# EAGLE design Backplane (EAGLE 6.4)
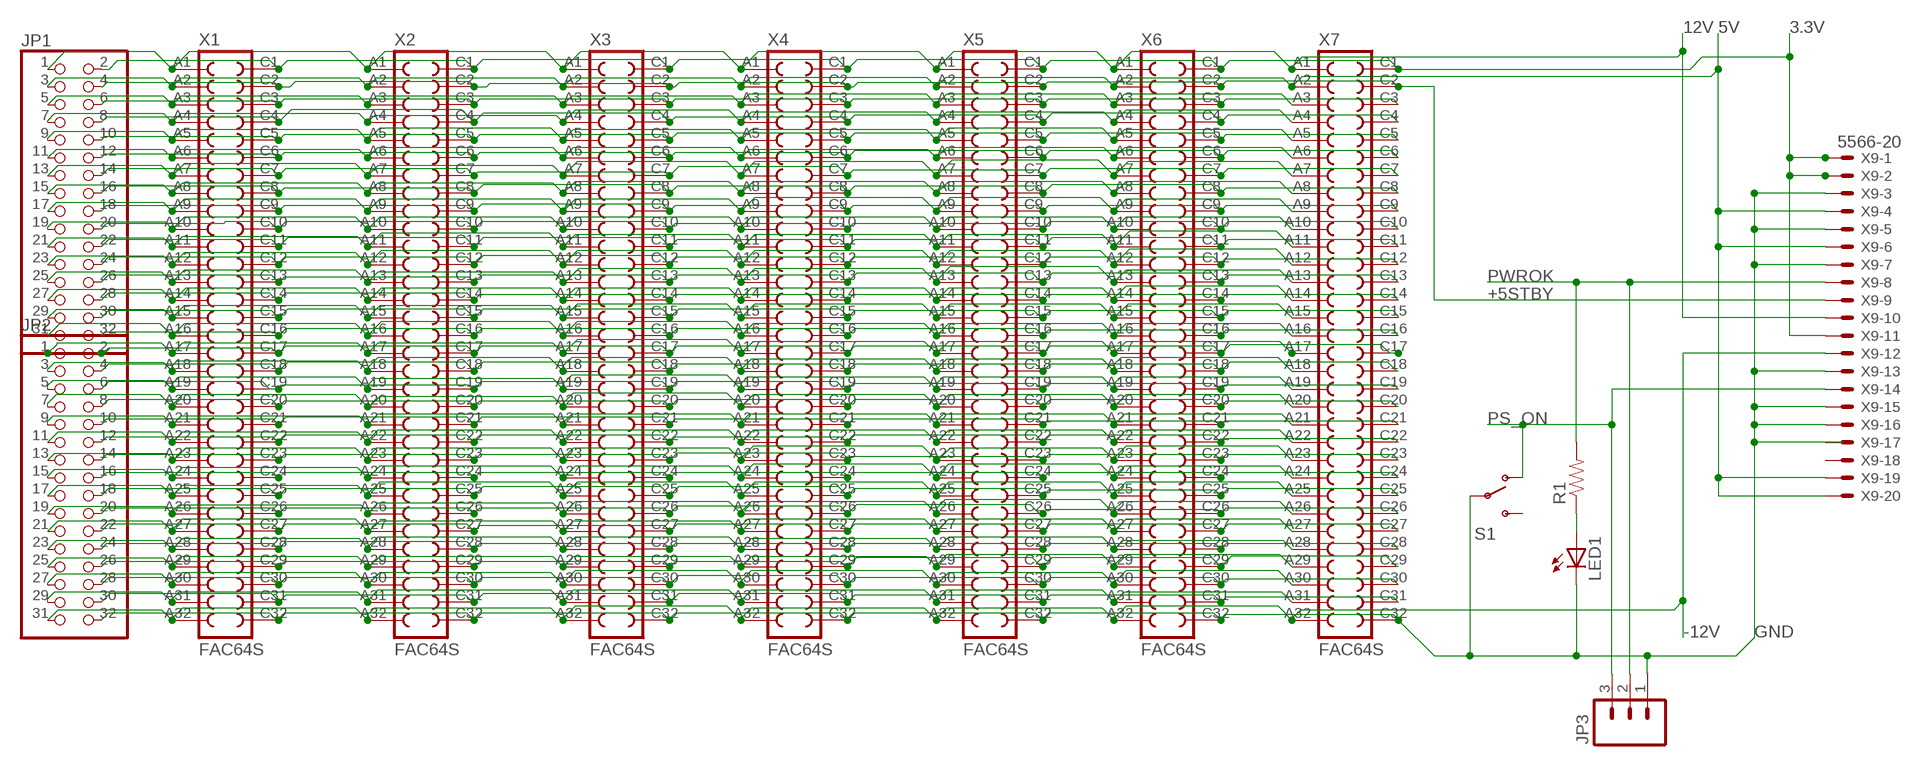
[diagram p0: schematic, sheet 1]

## Parts
JP1  PINHD-2X16  [2X16]
JP2  PINHD-2X16  [2X16]
JP3  M03LONGPADS  [1X03_LONGPADS]
LED1  LED3MM  [LED3MM]
R1  RESISTORKIT  [AXIAL-0.3-KIT]
S1  SWITCH-SPDTPTH  [SWITCH-SPDT]
X1  FAC64S  [FAC64S]
X2  FAC64S  [FAC64S]
X3  FAC64S  [FAC64S]
X4  FAC64S  [FAC64S]
X5  FAC64S  [FAC64S]
X6  FAC64S  [FAC64S]
X7  FAC64S  [FAC64S]
X9  5566-20  [5566-20]

## Nets
3.3V: JP1.2 X1.C1 X2.C1 X3.C1 X4.C1 X5.C1 X6.C1 X7.C1 X9.1 X9.2 X9.11
5V: JP1.3 X1.A2 X2.A2 X3.A2 X4.A2 X5.A2 X6.A2 X7.A2 X9.4 X9.6 X9.19 X9.20
12V: JP1.1 X1.A1 X2.A1 X3.A1 X4.A1 X5.A1 X6.A1 X7.A1 X9.10
+5STBY: JP1.4 X1.C2 X2.C2 X3.C2 X4.C2 X5.C2 X6.C2 X7.C2 X9.9
-12V: JP2.31 X1.A32 X2.A32 X3.A32 X4.A32 X5.A32 X6.A32 X7.A32 X9.12
GND: JP2.32 JP3.1 LED1.K(C) S1.2(P) X1.C32 X2.C32 X3.C32 X4.C32 X5.C32 X6.C32 X7.C32 X9.3 X9.5 X9.7 X9.13 X9.15 X9.16
N$1: LED1.A R1.P$1
N$5: JP1.5 X1.A3 X2.A3 X3.A3 X4.A3 X5.A3 X6.A3 X7.A3
N$6: JP1.6 X1.C3 X2.C3 X3.C3 X4.C3 X5.C3 X6.C3 X7.C3
N$7: JP1.7 X1.A4 X2.A4 X3.A4 X4.A4 X5.A4 X6.A4 X7.A4
N$8: JP1.8 X1.C4 X2.C4 X3.C4 X4.C4 X5.C4 X6.C4 X7.C4
N$9: JP1.9 X1.A5 X2.A5 X3.A5 X4.A5 X5.A5 X6.A5 X7.A5
N$10: JP1.10 X1.C5 X2.C5 X3.C5 X4.C5 X5.C5 X6.C5 X7.C5
N$11: JP1.11 X1.A6 X2.A6 X3.A6 X4.A6 X5.A6 X6.A6 X7.A6
N$12: JP1.12 X1.C6 X2.C6 X3.C6 X4.C6 X5.C6 X6.C6 X7.C6
N$13: JP1.13 X1.A7 X2.A7 X3.A7 X4.A7 X5.A7 X6.A7 X7.A7
N$14: JP1.14 X1.C7 X2.C7 X3.C7 X4.C7 X5.C7 X6.C7 X7.C7
N$15: JP1.15 X1.A8 X2.A8 X3.A8 X4.A8 X5.A8 X6.A8 X7.A8
N$16: JP1.16 X1.C8 X2.C8 X3.C8 X4.C8 X5.C8 X6.C8 X7.C8
N$17: JP1.17 X1.A9 X2.A9 X3.A9 X4.A9 X5.A9 X6.A9 X7.A9
N$80: JP1.18 X1.C9 X2.C9 X3.C9 X4.C9 X5.C9 X6.C9 X7.C9
N$81: JP1.19 X1.A10 X2.A10 X3.A10 X4.A10 X5.A10 X6.A10 X7.A10
N$82: JP1.20 X1.C10 X2.C10 X3.C10 X4.C10 X5.C10 X6.C10 X7.C10
N$83: JP1.21 X1.A11 X2.A11 X3.A11 X4.A11 X5.A11 X6.A11 X7.A11
N$84: JP1.22 X1.C11 X2.C11 X3.C11 X4.C11 X5.C11 X6.C11 X7.C11
N$85: JP1.23 X1.A12 X2.A12 X3.A12 X4.A12 X5.A12 X6.A12 X7.A12
N$86: JP1.24 X1.C12 X2.C12 X3.C12 X4.C12 X5.C12 X6.C12 X7.C12
N$87: JP1.25 X1.A13 X2.A13 X3.A13 X4.A13 X5.A13 X6.A13 X7.A13
N$88: JP1.26 X1.C13 X2.C13 X3.C13 X4.C13 X5.C13 X6.C13 X7.C13
N$89: JP1.27 X1.A14 X2.A14 X3.A14 X4.A14 X5.A14 X6.A14 X7.A14
N$90: JP1.28 X1.C14 X2.C14 X3.C14 X4.C14 X5.C14 X6.C14 X7.C14
N$91: JP1.29 X1.A15 X2.A15 X3.A15 X4.A15 X5.A15 X6.A15 X7.A15
N$92: JP1.30 X1.C15 X2.C15 X3.C15 X4.C15 X5.C15 X6.C15 X7.C15
N$93: JP1.31 X1.A16 X2.A16 X3.A16 X4.A16 X5.A16 X6.A16 X7.A16
N$94: JP1.32 X1.C16 X2.C16 X3.C16 X4.C16 X5.C16 X6.C16 X7.C16
N$95: JP2.1 X1.A17 X2.A17 X3.A17 X4.A17 X5.A17 X6.A17 X7.A17
N$96: JP2.2 X1.C17 X2.C17 X3.C17 X4.C17 X5.C17 X6.C17 X7.C17
N$98: JP2.3 X1.A18 X2.A18 X3.A18 X4.A18 X5.A18 X6.A18 X7.A18
N$99: JP2.4 X1.C18 X2.C18 X3.C18 X4.C18 X5.C18 X6.C18 X7.C18
N$100: JP2.5 X1.A19 X2.A19 X3.A19 X4.A19 X5.A19 X6.A19 X7.A19
N$101: JP2.6 X1.C19 X2.C19 X3.C19 X4.C19 X5.C19 X6.C19 X7.C19
N$102: JP2.7 X1.A20 X2.A20 X3.A20 X4.A20 X5.A20 X6.A20 X7.A20
N$103: JP2.8 X1.C20 X2.C20 X3.C20 X4.C20 X5.C20 X6.C20 X7.C20
N$104: JP2.9 X1.A21 X2.A21 X3.A21 X4.A21 X5.A21 X6.A21 X7.A21
N$105: JP2.10 X1.C21 X2.C21 X3.C21 X4.C21 X5.C21 X6.C21 X7.C21
N$106: JP2.11 X1.A22 X2.A22 X3.A22 X4.A22 X5.A22 X6.A22 X7.A22
N$107: JP2.12 X1.C22 X2.C22 X3.C22 X4.C22 X5.C22 X6.C22 X7.C22
N$108: JP2.13 X1.A23 X2.A23 X3.A23 X4.A23 X5.A23 X6.A23 X7.A23
N$109: JP2.14 X1.C23 X2.C23 X3.C23 X4.C23 X5.C23 X6.C23 X7.C23
N$110: JP2.15 X1.A24 X2.A24 X3.A24 X4.A24 X5.A24 X6.A24 X7.A24
N$111: JP2.16 X1.C24 X2.C24 X3.C24 X4.C24 X5.C24 X6.C24 X7.C24
N$112: JP2.17 X1.A25 X2.A25 X3.A25 X4.A25 X5.A25 X6.A25 X7.A25
N$113: JP2.18 X1.C25 X2.C25 X3.C25 X4.C25 X5.C25 X6.C25 X7.C25
N$114: JP2.19 X1.A26 X2.A26 X3.A26 X4.A26 X5.A26 X6.A26 X7.A26
N$115: JP2.20 X1.C26 X2.C26 X3.C26 X4.C26 X5.C26 X6.C26 X7.C26
N$116: JP2.21 X1.A27 X2.A27 X3.A27 X4.A27 X5.A27 X6.A27 X7.A27
N$117: JP2.22 X1.C27 X2.C27 X3.C27 X4.C27 X5.C27 X6.C27 X7.C27
N$118: JP2.23 X1.A28 X2.A28 X3.A28 X4.A28 X5.A28 X6.A28 X7.A28
N$119: JP2.24 X1.C28 X2.C28 X3.C28 X4.C28 X5.C28 X6.C28 X7.C28
N$120: JP2.25 X1.A29 X2.A29 X3.A29 X4.A29 X5.A29 X6.A29 X7.A29
N$121: JP2.26 X1.C29 X2.C29 X3.C29 X4.C29 X5.C29 X6.C29 X7.C29
N$122: JP2.27 X1.A30 X2.A30 X3.A30 X4.A30 X5.A30 X6.A30 X7.A30
N$123: JP2.28 X1.C30 X2.C30 X3.C30 X4.C30 X5.C30 X6.C30 X7.C30
N$124: JP2.29 X1.A31 X2.A31 X3.A31 X4.A31 X5.A31 X6.A31 X7.A31
N$125: JP2.30 X1.C31 X2.C31 X3.C31 X4.C31 X5.C31 X6.C31 X7.C31
PS_ON: JP3.3 S1.1(O) X9.14
PWROK: JP3.2 R1.P$2 X9.8
Unconnected: S1.3(S) X9.17 X9.18

## Library data of the parts
JP1 JP2 = pinhead:PINHD-2X16: PIN HEADER
JP3 = SparkFun-Connectors:M03: Header 3 Standard 3-pin 0.1" header. Use with straight break away headers (SKU : PRT-00116), right angle break away headers (PRT-00553), swiss pins (PRT-00743), machine pins (PRT-00117), and female headers (PRT-00115). Molex polarized connector foot print use with SKU : PRT-08232 with associated crimp pins and housings.
LED1 = SparkFun-LED:LED: LEDs Standard schematic elements and footprints for 5mm, 3mm, 1206, and 0603 sized LEDs. 5mm - Spark Fun Electronics SKU : COM-00529 (and others)
R1 = SparkFun-Passives:RESISTOR: Resistor Basic schematic elements and footprints for 0603, 1206, and PTH resistors.
S1 = SparkFun-Electromechanical:SWITCH-SPDT: SPDT Switch Simple slide switch, Spark Fun Electronics SKU : COM-00102 DPDT SMT slide switch, AYZ0202, SWCH-08179
X1-X7 = con-vg:FAC64S: CONNECTOR female, 64 pins, block, type C, rows AC, grid 5.08 mm
X9 = con-molex:5566-20: Mini FIT connector 20 pol ATX PC-Motherboard Power connector Source: http://www.molex.com; OC_FARNELL: unknown; OC_NEWARK: unknown

## Board
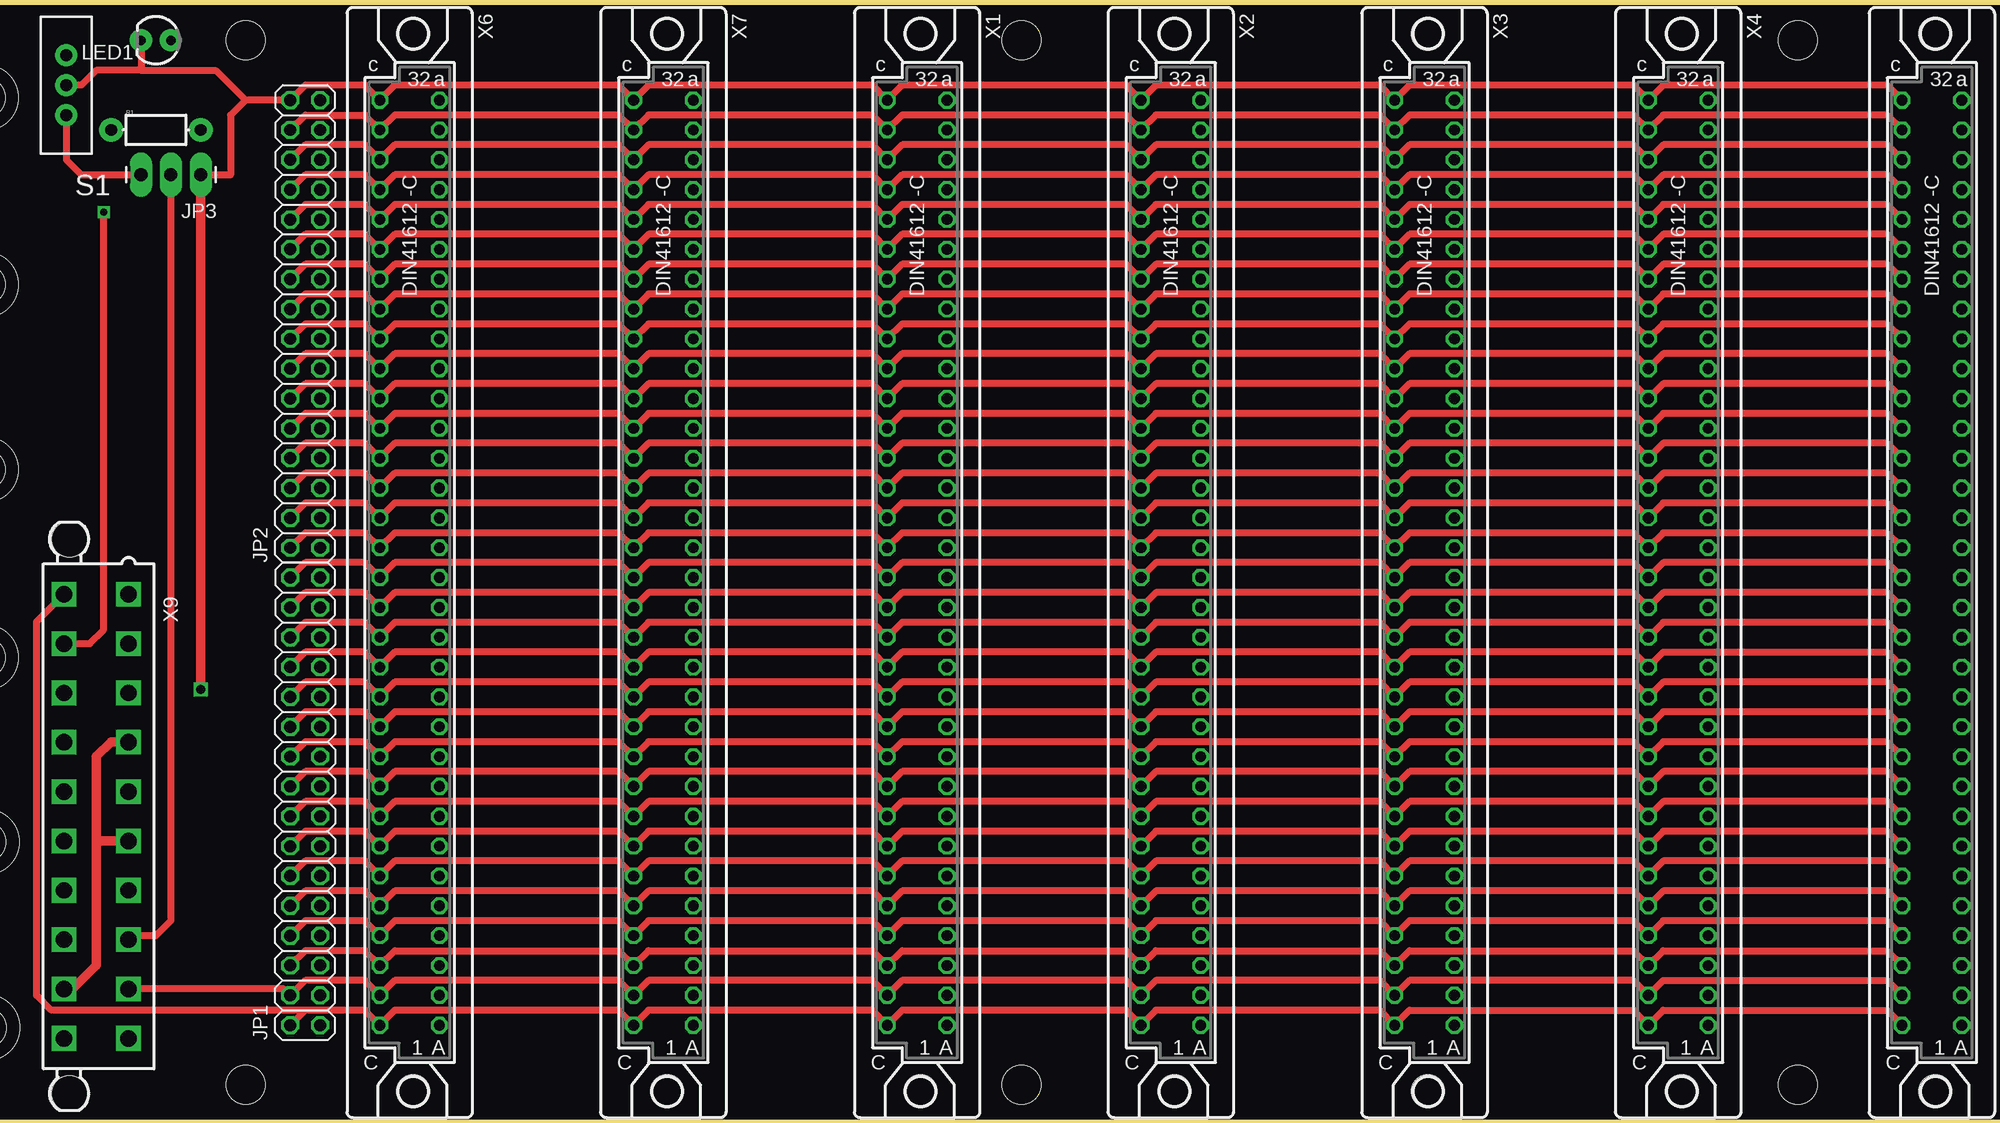
[diagram p1: board, top side]
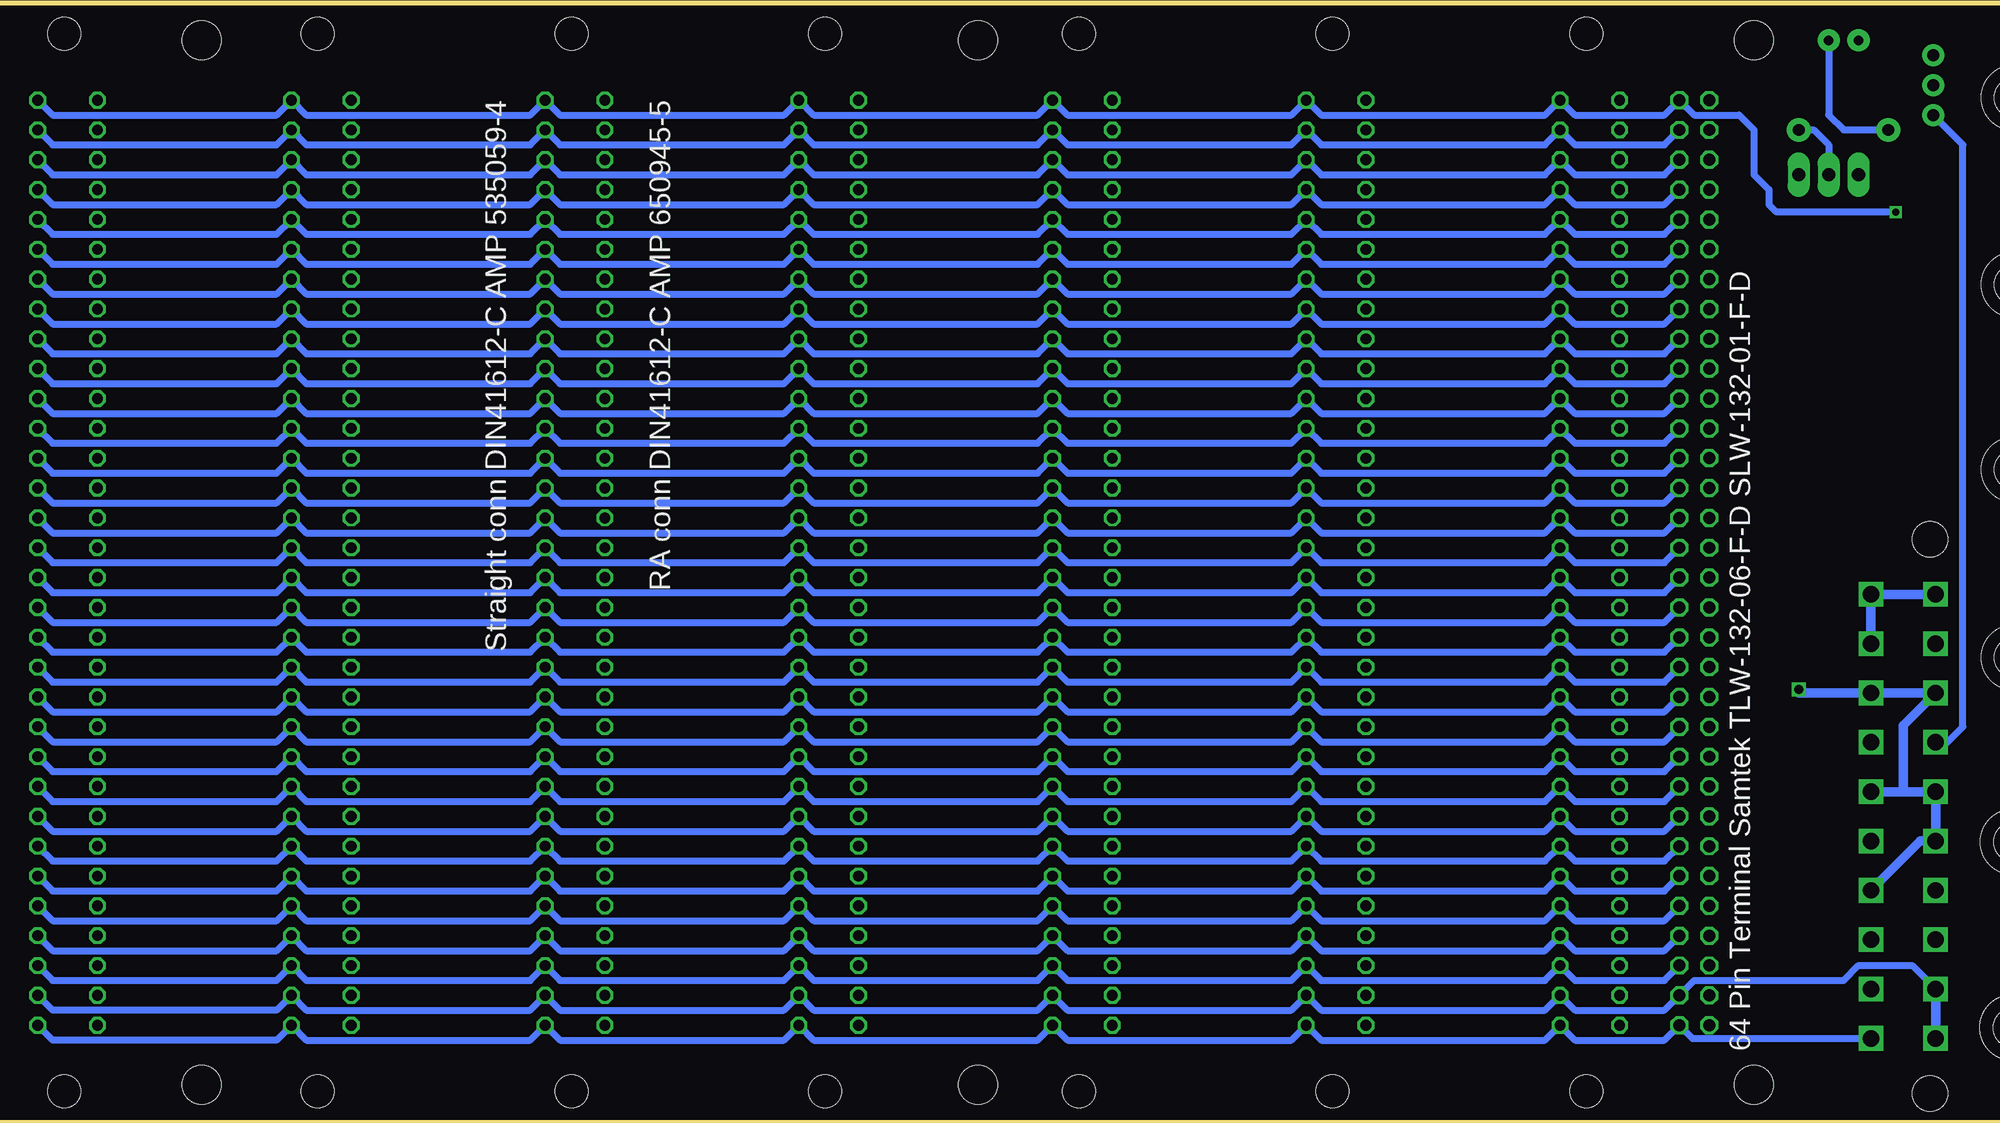
[diagram p2: board, bottom side, seen from below]

No outline drawn. Coordinates in mm, seen from the top.
Copper layers (1*16): Top 0.035mm / dielectric 1.5mm / Bottom 0.035mm
Design rules "default": minimum track width 10mil, minimum drill 24mil, track to track 8mil, track to pad 8mil, pad to pad 8mil, via to via 8mil, smd to smd 8mil, copper to edge 40mil, drill to drill 8mil, minimum pad ring 10mil, minimum via ring 8mil, stop-mask expansion 4mil, vias tented up to drill 0mil, thermal gap 10mil
Holes 5.54 mm at 184.66,74.78 184.66,91.59 7.11,90.37 7.11,74.47 7.11,58.72 7.11,42.72 7.16,27.03 7.21,11.23 184.76,58.78 184.76,42.77 184.71,27.08 184.66,11.28
Milling: 8 lines

### Footprints (pad centres in the part's own frame; a part is rotated, then mirrored left to right if it is on the bottom)
2X16 = drill 1.016 octagon: 1 -19.05,-1.27; 2 -19.05,1.27; 3 -16.51,-1.27; 4 -16.51,1.27; 5 -13.97,-1.27; 6 -13.97,1.27; 7 -11.43,-1.27; 8 -11.43,1.27; 9 -8.89,-1.27; 10 -8.89,1.27; 11 -6.35,-1.27; 12 -6.35,1.27; 13 -3.81,-1.27; 14 -3.81,1.27; 15 -1.27,-1.27; 16 -1.27,1.27; 17 1.27,-1.27; 18 1.27,1.27; 19 3.81,-1.27; 20 3.81,1.27; 21 6.35,-1.27; 22 6.35,1.27; 23 8.89,-1.27; 24 8.89,1.27; 25 11.43,-1.27; 26 11.43,1.27; 27 13.97,-1.27; 28 13.97,1.27; 29 16.51,-1.27; 30 16.51,1.27; 31 19.05,-1.27; 32 19.05,1.27
1X03_LONGPADS = drill 1.118 pad 1.88 long: 1 0,0; 2 2.54,0; 3 5.08,0
LED3MM = drill 0.813 pad 1.88: A -1.27,0; K 1.27,0
AXIAL-0.3-KIT = drill 1.016 pad 2.032: P$1 -3.81,0; P$2 3.81,0
SWITCH-SPDT = drill 1.016 pad 1.88: 1 0,2.54; 2 0,0; 3 0,-2.54
STAND-OFF = hole 3.302: 0,0
FAC64S = drill 0.914 octagon: A1 -2.54,39.37; A2 -2.54,36.83; A3 -2.54,34.29; A4 -2.54,31.75; A5 -2.54,29.21; A6 -2.54,26.67; A7 -2.54,24.13; A8 -2.54,21.59; A9 -2.54,19.05; A10 -2.54,16.51; A11 -2.54,13.97; A12 -2.54,11.43; A13 -2.54,8.89; A14 -2.54,6.35; A15 -2.54,3.81; A16 -2.54,1.27; A17 -2.54,-1.27; A18 -2.54,-3.81; A19 -2.54,-6.35; A20 -2.54,-8.89; A21 -2.54,-11.43; A22 -2.54,-13.97; A23 -2.54,-16.51; A24 -2.54,-19.05; A25 -2.54,-21.59; A26 -2.54,-24.13; A27 -2.54,-26.67; A28 -2.54,-29.21; A29 -2.54,-31.75; A30 -2.54,-34.29; A31 -2.54,-36.83; A32 -2.54,-39.37; C1 2.54,39.37; C2 2.54,36.83; C3 2.54,34.29; C4 2.54,31.75; C5 2.54,29.21; C6 2.54,26.67; C7 2.54,24.13; C8 2.54,21.59; C9 2.54,19.05; C10 2.54,16.51; C11 2.54,13.97; C12 2.54,11.43; C13 2.54,8.89; C14 2.54,6.35; C15 2.54,3.81; C16 2.54,1.27; C17 2.54,-1.27; C18 2.54,-3.81; C19 2.54,-6.35; C20 2.54,-8.89; C21 2.54,-11.43; C22 2.54,-13.97; C23 2.54,-16.51; C24 2.54,-19.05; C25 2.54,-21.59; C26 2.54,-24.13; C27 2.54,-26.67; C28 2.54,-29.21; C29 2.54,-31.75; C30 2.54,-34.29; C31 2.54,-36.83; C32 2.54,-39.37 | hole 2.794: -0.305,45.009; -0.305,-45.009
5566-20 = drill 1.4 square: 1 18.9,-2.75; 2 14.7,-2.75; 3 10.5,-2.75; 4 6.3,-2.75; 5 2.1,-2.75; 6 -2.1,-2.75; 7 -6.3,-2.75; 8 -10.5,-2.75; 9 -14.7,-2.75; 10 -18.9,-2.75; 11 18.9,2.75; 12 14.7,2.75; 13 10.5,2.75; 14 6.3,2.75; 15 2.1,2.75; 16 -2.1,2.75; 17 -6.3,2.75; 18 -10.5,2.75; 19 -14.7,2.75; 20 -18.9,2.75 | hole 3: 23.6,2.29; -23.6,2.29

### Placement (x,y rotation side)
JP1  34.29,30.48 90 top
JP2  34.29,71.12 90 top
JP3  25.4,83.82 180 top
LED1  21.59,95.25 180 top
R1  21.59,87.63 0 top
S1  13.97,91.44 180 top
U$1  [STAND-OFF]  95.25,6.35 180 top
U$2  [STAND-OFF]  95.25,95.25 180 top
U$3  [STAND-OFF]  184.76,42.77 0 bottom
U$4  [STAND-OFF]  184.76,58.78 0 bottom
U$5  [STAND-OFF]  184.71,27.08 90 bottom
U$6  [STAND-OFF]  184.66,11.28 0 bottom
U$7  [STAND-OFF]  161.29,6.35 180 top
U$8  [STAND-OFF]  161.29,95.25 180 top
U$9  [STAND-OFF]  29.21,6.35 180 top
U$10  [STAND-OFF]  29.21,95.25 180 top
U$13  [STAND-OFF]  184.66,74.78 180 top
U$14  [STAND-OFF]  184.66,91.59 180 top
U$19  [STAND-OFF]  7.11,42.72 0 top
U$20  [STAND-OFF]  7.11,58.72 0 top
U$21  [STAND-OFF]  7.16,27.03 90 top
U$22  [STAND-OFF]  7.21,11.23 0 top
U$23  [STAND-OFF]  7.11,74.47 180 top
U$24  [STAND-OFF]  7.11,90.37 180 top
X1  86.36,50.8 180 top
X2  107.95,50.8 180 top
X3  129.54,50.8 180 top
X4  151.13,50.8 180 top
X5  172.72,50.8 180 top
X6  43.18,50.8 180 top
X7  64.77,50.8 180 top
X9  16.51,29.21 90 top

### Tracks (layer width: path | path; a pad name or v marks a point on that pad's centre or on a via)
3.3V
  Top 0.61: X5.C1 168.91,12.7 149.86,12.7 X4.C1 147.32,12.7 128.27,12.7 X3.C1 125.73,12.7 106.68,12.7 X2.C1 104.14,12.7 85.09,12.7 X1.C1 82.55,12.7 63.5,12.7 X7.C1 60.96,12.7 41.91,12.7 X6.C1 39.37,12.7 34.29,12.7 | 34.29,12.7 JP1.2 | 34.29,12.7 12.7,12.7 11.43,13.97 11.43,45.78 X9.11
  Bottom 0.813: X9.2 X9.1 X9.11
5V
  Top 0.813: X9.4 19.21,35.56 17.78,35.56 16.51,34.29 16.51,26.67 | 16.51,26.67 16.51,16.51 14.51,14.51 X9.19 | X9.6 16.95,27.11 arc90 16.51,26.67
  Bottom 0.61: X5.A2 173.99,12.7 154.94,12.7 X4.A2 152.4,12.7 133.35,12.7 X3.A2 130.81,12.7 111.76,12.7 X2.A2 109.22,12.7 90.17,12.7 X1.A2 87.63,12.7 68.58,12.7 X7.A2 66.04,12.7 46.99,12.7 X6.A2 44.45,12.7 36.83,12.7 JP1.3 34.29,15.24 21.59,15.24 20.32,16.51 15.76,16.51 X9.19
  Bottom 0.813: X9.20 X9.19
12V
  Bottom 0.61: X5.A1 173.99,10.16 154.94,10.16 X4.A1 152.4,10.16 133.35,10.16 X3.A1 130.81,10.16 111.76,10.16 X2.A1 109.22,10.16 90.17,10.16 X1.A1 87.63,10.16 68.58,10.16 X7.A1 66.04,10.16 46.99,10.16 X6.A1 44.45,10.16 36.83,10.16 JP1.1 34.44,10.31 X9.10
+5STBY
  Top 0.61: X5.C2 168.91,15.24 149.86,15.24 X4.C2 147.32,15.24 128.27,15.24 X3.C2 125.73,15.24 106.68,15.24 X2.C2 104.14,15.24 85.09,15.24 X1.C2 82.55,15.24 63.5,15.24 X7.C2 60.96,15.24 41.91,15.24 X6.C2 39.37,15.24 34.29,15.24 JP1.4 32.48,14.51 X9.9
-12V  (via drill 0.6)
  Top 0.61: X9.12 15.97,43.91 17.14,45.09 v17.14,80.64
  Bottom 0.61: X5.A32 173.99,88.9 154.94,88.9 X4.A32 152.4,88.9 133.35,88.9 X3.A32 130.81,88.9 111.76,88.9 X2.A32 109.22,88.9 90.17,88.9 X1.A32 87.63,88.9 68.58,88.9 X7.A32 66.04,88.9 46.99,88.9 X6.A32 44.45,88.9 36.83,88.9 JP2.31 34.29,88.9 30.48,88.9 29.21,87.63 29.21,83.82 27.94,82.55 27.94,81.28 27.3,80.64 v17.14,80.64
GND  (via drill 0.8)
  Top 0.61: X5.C32 168.91,91.44 149.86,91.44 X4.C32 147.32,91.44 128.27,91.44 X3.C32 125.73,91.44 106.68,91.44 X2.C32 104.14,91.44 85.09,91.44 X1.C32 82.55,91.44 63.5,91.44 X7.C32 60.96,91.44 41.91,91.44 X6.C32 39.37,91.44 34.29,91.44 JP2.32 29.21,90.17 | 29.21,90.17 27.94,88.9 27.94,83.82 JP3.1 | LED1.K 20.32,92.71 | 20.32,92.71 26.67,92.71 29.21,90.17 | 20.32,92.71 16.51,92.71 15.24,91.44 S1.2
  Top 0.813: JP3.1 v25.4,40.01
  Bottom 0.813: X9.5 16.51,31.31 | 16.51,31.31 X9.15 X9.16 15.06,27.11 X9.7 | X9.3 X9.13 16.51,36.96 16.51,31.31 | X9.3 20.66,39.71 | v25.4,40.01 25.4,39.71 X9.3
N$1
  Bottom 0.61: LED1.A 22.86,88.9 21.59,87.63 R1.P$1
N$5
  Bottom 0.61: X5.A3 173.99,15.24 154.94,15.24 X4.A3 152.4,15.24 133.35,15.24 X3.A3 130.81,15.24 111.76,15.24 X2.A3 109.22,15.24 90.17,15.24 X1.A3 87.63,15.24 68.58,15.24 X7.A3 66.04,15.24 46.99,15.24 X6.A3 44.45,15.24 36.83,15.24 JP1.5
N$6
  Top 0.61: X5.C3 168.91,17.78 149.86,17.78 X4.C3 147.32,17.78 128.27,17.78 X3.C3 125.73,17.78 106.68,17.78 X2.C3 104.14,17.78 85.09,17.78 X1.C3 82.55,17.78 63.5,17.78 X7.C3 60.96,17.78 41.91,17.78 X6.C3 39.37,17.78 34.29,17.78 JP1.6
N$7
  Bottom 0.61: X5.A4 173.99,17.78 154.94,17.78 X4.A4 152.4,17.78 133.35,17.78 X3.A4 130.81,17.78 111.76,17.78 X2.A4 109.22,17.78 90.17,17.78 X1.A4 87.63,17.78 68.58,17.78 X7.A4 66.04,17.78 46.99,17.78 X6.A4 44.45,17.78 36.83,17.78 JP1.7
N$8
  Top 0.61: X5.C4 168.91,20.32 149.86,20.32 X4.C4 147.32,20.32 128.27,20.32 X3.C4 125.73,20.32 106.68,20.32 X2.C4 104.14,20.32 85.09,20.32 X1.C4 82.55,20.32 63.5,20.32 X7.C4 60.96,20.32 41.91,20.32 X6.C4 39.37,20.32 34.29,20.32 JP1.8
N$9
  Bottom 0.61: X5.A5 173.99,20.32 154.94,20.32 X4.A5 152.4,20.32 133.35,20.32 X3.A5 130.81,20.32 111.76,20.32 X2.A5 109.22,20.32 90.17,20.32 X1.A5 87.63,20.32 68.58,20.32 X7.A5 66.04,20.32 46.99,20.32 X6.A5 44.45,20.32 36.83,20.32 JP1.9
N$10
  Top 0.61: X5.C5 168.91,22.86 149.86,22.86 X4.C5 147.32,22.86 128.27,22.86 X3.C5 125.73,22.86 106.68,22.86 X2.C5 104.14,22.86 85.09,22.86 X1.C5 82.55,22.86 63.5,22.86 X7.C5 60.96,22.86 41.91,22.86 X6.C5 39.37,22.86 34.29,22.86 JP1.10
N$11
  Bottom 0.61: X5.A6 173.99,22.86 154.94,22.86 X4.A6 152.4,22.86 133.35,22.86 X3.A6 130.81,22.86 111.76,22.86 X2.A6 109.22,22.86 90.17,22.86 X1.A6 87.63,22.86 68.58,22.86 X7.A6 66.04,22.86 46.99,22.86 X6.A6 44.45,22.86 36.83,22.86 JP1.11
N$12
  Top 0.61: X5.C6 168.91,25.4 149.86,25.4 X4.C6 147.32,25.4 128.27,25.4 X3.C6 125.73,25.4 106.68,25.4 X2.C6 104.14,25.4 85.09,25.4 X1.C6 82.55,25.4 63.5,25.4 X7.C6 60.96,25.4 41.91,25.4 X6.C6 39.37,25.4 34.29,25.4 JP1.12
N$13
  Bottom 0.61: X5.A7 173.99,25.4 154.94,25.4 X4.A7 152.4,25.4 133.35,25.4 X3.A7 130.81,25.4 111.76,25.4 X2.A7 109.22,25.4 90.17,25.4 X1.A7 87.63,25.4 68.58,25.4 X7.A7 66.04,25.4 46.99,25.4 X6.A7 44.45,25.4 36.83,25.4 JP1.13
N$14
  Top 0.61: X5.C7 168.91,27.94 149.86,27.94 X4.C7 147.32,27.94 128.27,27.94 X3.C7 125.73,27.94 106.68,27.94 X2.C7 104.14,27.94 85.09,27.94 X1.C7 82.55,27.94 63.5,27.94 X7.C7 60.96,27.94 41.91,27.94 X6.C7 39.37,27.94 34.29,27.94 JP1.14
N$15
  Bottom 0.61: X5.A8 173.99,27.94 154.94,27.94 X4.A8 152.4,27.94 133.35,27.94 X3.A8 130.81,27.94 111.76,27.94 X2.A8 109.22,27.94 90.17,27.94 X1.A8 87.63,27.94 68.58,27.94 X7.A8 66.04,27.94 46.99,27.94 X6.A8 44.45,27.94 36.83,27.94 JP1.15
N$16
  Top 0.61: X5.C8 168.91,30.48 149.86,30.48 X4.C8 147.32,30.48 128.27,30.48 X3.C8 125.73,30.48 106.68,30.48 X2.C8 104.14,30.48 85.09,30.48 X1.C8 82.55,30.48 63.5,30.48 X7.C8 60.96,30.48 41.91,30.48 X6.C8 39.37,30.48 34.29,30.48 JP1.16
N$17
  Bottom 0.61: X5.A9 173.99,30.48 154.94,30.48 X4.A9 152.4,30.48 133.35,30.48 X3.A9 130.81,30.48 111.76,30.48 X2.A9 109.22,30.48 90.17,30.48 X1.A9 87.63,30.48 68.58,30.48 X7.A9 66.04,30.48 46.99,30.48 X6.A9 44.45,30.48 36.83,30.48 JP1.17
N$80
  Top 0.61: X5.C9 168.91,33.02 149.86,33.02 X4.C9 147.32,33.02 128.27,33.02 X3.C9 125.73,33.02 106.68,33.02 X2.C9 104.14,33.02 85.09,33.02 X1.C9 82.55,33.02 63.5,33.02 X7.C9 60.96,33.02 41.91,33.02 X6.C9 39.37,33.02 34.29,33.02 JP1.18
N$81
  Bottom 0.61: X5.A10 173.99,33.02 154.94,33.02 X4.A10 152.4,33.02 133.35,33.02 X3.A10 130.81,33.02 111.76,33.02 X2.A10 109.22,33.02 90.17,33.02 X1.A10 87.63,33.02 68.58,33.02 X7.A10 66.04,33.02 46.99,33.02 X6.A10 44.45,33.02 36.83,33.02 JP1.19
N$82
  Top 0.61: X5.C10 168.91,35.56 149.86,35.56 X4.C10 147.32,35.56 128.27,35.56 X3.C10 125.73,35.56 106.68,35.56 X2.C10 104.14,35.56 85.09,35.56 X1.C10 82.55,35.56 63.5,35.56 X7.C10 60.96,35.56 41.91,35.56 X6.C10 39.37,35.56 34.29,35.56 JP1.20
N$83
  Bottom 0.61: X5.A11 173.99,35.56 154.94,35.56 X4.A11 152.4,35.56 133.35,35.56 X3.A11 130.81,35.56 111.76,35.56 X2.A11 109.22,35.56 90.17,35.56 X1.A11 87.63,35.56 68.58,35.56 X7.A11 66.04,35.56 46.99,35.56 X6.A11 44.45,35.56 36.83,35.56 JP1.21
N$84
  Top 0.61: X5.C11 168.91,38.1 149.86,38.1 X4.C11 147.32,38.1 128.27,38.1 X3.C11 125.73,38.1 106.68,38.1 X2.C11 104.14,38.1 85.09,38.1 X1.C11 82.55,38.1 63.5,38.1 X7.C11 60.96,38.1 41.91,38.1 X6.C11 39.37,38.1 34.29,38.1 JP1.22
N$85
  Bottom 0.61: X5.A12 173.99,38.1 154.94,38.1 X4.A12 152.4,38.1 133.35,38.1 X3.A12 130.81,38.1 111.76,38.1 X2.A12 109.22,38.1 90.17,38.1 X1.A12 87.63,38.1 68.58,38.1 X7.A12 66.04,38.1 46.99,38.1 X6.A12 44.45,38.1 36.83,38.1 JP1.23
N$86
  Top 0.61: X5.C12 168.91,40.64 149.86,40.64 X4.C12 147.32,40.64 128.27,40.64 X3.C12 125.73,40.64 106.68,40.64 X2.C12 104.14,40.64 85.09,40.64 X1.C12 82.55,40.64 63.5,40.64 X7.C12 60.96,40.64 41.91,40.64 X6.C12 39.37,40.64 34.29,40.64 JP1.24
N$87
  Bottom 0.61: X5.A13 173.99,40.64 154.94,40.64 X4.A13 152.4,40.64 133.35,40.64 X3.A13 130.81,40.64 111.76,40.64 X2.A13 109.22,40.64 90.17,40.64 X1.A13 87.63,40.64 68.58,40.64 X7.A13 66.04,40.64 46.99,40.64 X6.A13 44.45,40.64 36.83,40.64 JP1.25
N$88
  Top 0.61: X5.C13 168.91,43.18 149.86,43.18 X4.C13 147.32,43.18 128.27,43.18 X3.C13 125.73,43.18 106.68,43.18 X2.C13 104.14,43.18 85.09,43.18 X1.C13 82.55,43.18 63.5,43.18 X7.C13 60.96,43.18 41.91,43.18 X6.C13 39.37,43.18 34.29,43.18 JP1.26
N$89
  Bottom 0.61: X5.A14 173.99,43.18 154.94,43.18 X4.A14 152.4,43.18 133.35,43.18 X3.A14 130.81,43.18 111.76,43.18 X2.A14 109.22,43.18 90.17,43.18 X1.A14 87.63,43.18 68.58,43.18 X7.A14 66.04,43.18 46.99,43.18 X6.A14 44.45,43.18 36.83,43.18 JP1.27
N$90
  Top 0.61: X5.C14 168.91,45.72 149.86,45.72 X4.C14 147.32,45.72 128.27,45.72 X3.C14 125.73,45.72 106.68,45.72 X2.C14 104.14,45.72 85.09,45.72 X1.C14 82.55,45.72 63.5,45.72 X7.C14 60.96,45.72 41.91,45.72 X6.C14 39.37,45.72 34.29,45.72 JP1.28
N$91
  Bottom 0.61: X5.A15 173.99,45.72 154.94,45.72 X4.A15 152.4,45.72 133.35,45.72 X3.A15 130.81,45.72 111.76,45.72 X2.A15 109.22,45.72 90.17,45.72 X1.A15 87.63,45.72 68.58,45.72 X7.A15 66.04,45.72 46.99,45.72 X6.A15 44.45,45.72 36.83,45.72 JP1.29
N$92
  Top 0.61: X5.C15 168.91,48.26 149.86,48.26 X4.C15 147.32,48.26 128.27,48.26 X3.C15 125.73,48.26 106.68,48.26 X2.C15 104.14,48.26 85.09,48.26 X1.C15 82.55,48.26 63.5,48.26 X7.C15 60.96,48.26 41.91,48.26 X6.C15 39.37,48.26 34.29,48.26 JP1.30
N$93
  Bottom 0.61: X5.A16 173.99,48.26 154.94,48.26 X4.A16 152.4,48.26 133.35,48.26 X3.A16 130.81,48.26 111.76,48.26 X2.A16 109.22,48.26 90.17,48.26 X1.A16 87.63,48.26 68.58,48.26 X7.A16 66.04,48.26 46.99,48.26 X6.A16 44.45,48.26 36.83,48.26 JP1.31
N$94
  Top 0.61: X5.C16 168.91,50.8 149.86,50.8 X4.C16 147.32,50.8 128.27,50.8 X3.C16 125.73,50.8 106.68,50.8 X2.C16 104.14,50.8 85.09,50.8 X1.C16 82.55,50.8 63.5,50.8 X7.C16 60.96,50.8 41.91,50.8 X6.C16 39.37,50.8 34.29,50.8 JP1.32
N$95
  Bottom 0.61: X5.A17 173.99,50.8 154.94,50.8 X4.A17 152.4,50.8 133.35,50.8 X3.A17 130.81,50.8 111.76,50.8 X2.A17 109.22,50.8 90.17,50.8 X1.A17 87.63,50.8 68.58,50.8 X7.A17 66.04,50.8 46.99,50.8 X6.A17 44.45,50.8 36.83,50.8 JP2.1
N$96
  Top 0.61: X5.C17 168.91,53.34 149.86,53.34 X4.C17 147.32,53.34 128.27,53.34 X3.C17 125.73,53.34 106.68,53.34 X2.C17 104.14,53.34 85.09,53.34 X1.C17 82.55,53.34 63.5,53.34 X7.C17 60.96,53.34 41.91,53.34 X6.C17 39.37,53.34 34.29,53.34 JP2.2
N$98
  Bottom 0.61: X5.A18 173.99,53.34 154.94,53.34 X4.A18 152.4,53.34 133.35,53.34 X3.A18 130.81,53.34 111.76,53.34 X2.A18 109.22,53.34 90.17,53.34 X1.A18 87.63,53.34 68.58,53.34 X7.A18 66.04,53.34 46.99,53.34 X6.A18 44.45,53.34 36.83,53.34 JP2.3
N$99
  Top 0.61: X5.C18 168.91,55.88 149.86,55.88 X4.C18 147.32,55.88 128.27,55.88 X3.C18 125.73,55.88 106.68,55.88 X2.C18 104.14,55.88 85.09,55.88 X1.C18 82.55,55.88 63.5,55.88 X7.C18 60.96,55.88 41.91,55.88 X6.C18 39.37,55.88 34.29,55.88 JP2.4
N$100
  Bottom 0.61: X5.A19 173.99,55.88 154.94,55.88 X4.A19 152.4,55.88 133.35,55.88 X3.A19 130.81,55.88 111.76,55.88 X2.A19 109.22,55.88 90.17,55.88 X1.A19 87.63,55.88 68.58,55.88 X7.A19 66.04,55.88 46.99,55.88 X6.A19 44.45,55.88 36.83,55.88 JP2.5
N$101
  Top 0.61: X5.C19 168.91,58.42 149.86,58.42 X4.C19 147.32,58.42 128.27,58.42 X3.C19 125.73,58.42 106.68,58.42 X2.C19 104.14,58.42 85.09,58.42 X1.C19 82.55,58.42 63.5,58.42 X7.C19 60.96,58.42 41.91,58.42 X6.C19 39.37,58.42 34.29,58.42 JP2.6
N$102
  Bottom 0.61: X5.A20 173.99,58.42 154.94,58.42 X4.A20 152.4,58.42 133.35,58.42 X3.A20 130.81,58.42 111.76,58.42 X2.A20 109.22,58.42 90.17,58.42 X1.A20 87.63,58.42 68.58,58.42 X7.A20 66.04,58.42 46.99,58.42 X6.A20 44.45,58.42 36.83,58.42 JP2.7
N$103
  Top 0.61: X5.C20 168.91,60.96 149.86,60.96 X4.C20 147.32,60.96 128.27,60.96 X3.C20 125.73,60.96 106.68,60.96 X2.C20 104.14,60.96 85.09,60.96 X1.C20 82.55,60.96 63.5,60.96 X7.C20 60.96,60.96 41.91,60.96 X6.C20 39.37,60.96 34.29,60.96 JP2.8
N$104
  Bottom 0.61: X5.A21 173.99,60.96 154.94,60.96 X4.A21 152.4,60.96 133.35,60.96 X3.A21 130.81,60.96 111.76,60.96 X2.A21 109.22,60.96 90.17,60.96 X1.A21 87.63,60.96 68.58,60.96 X7.A21 66.04,60.96 46.99,60.96 X6.A21 44.45,60.96 36.83,60.96 JP2.9
N$105
  Top 0.61: X5.C21 168.91,63.5 149.86,63.5 X4.C21 147.32,63.5 128.27,63.5 X3.C21 125.73,63.5 106.68,63.5 X2.C21 104.14,63.5 85.09,63.5 X1.C21 82.55,63.5 63.5,63.5 X7.C21 60.96,63.5 41.91,63.5 X6.C21 39.37,63.5 34.29,63.5 JP2.10
N$106
  Bottom 0.61: X5.A22 173.99,63.5 154.94,63.5 X4.A22 152.4,63.5 133.35,63.5 X3.A22 130.81,63.5 111.76,63.5 X2.A22 109.22,63.5 90.17,63.5 X1.A22 87.63,63.5 68.58,63.5 X7.A22 66.04,63.5 46.99,63.5 X6.A22 44.45,63.5 36.83,63.5 JP2.11
N$107
  Top 0.61: X5.C22 168.91,66.04 149.86,66.04 X4.C22 147.32,66.04 128.27,66.04 X3.C22 125.73,66.04 106.68,66.04 X2.C22 104.14,66.04 85.09,66.04 X1.C22 82.55,66.04 63.5,66.04 X7.C22 60.96,66.04 41.91,66.04 X6.C22 39.37,66.04 34.29,66.04 JP2.12
N$108
  Bottom 0.61: X5.A23 173.99,66.04 154.94,66.04 X4.A23 152.4,66.04 133.35,66.04 X3.A23 130.81,66.04 111.76,66.04 X2.A23 109.22,66.04 90.17,66.04 X1.A23 87.63,66.04 68.58,66.04 X7.A23 66.04,66.04 46.99,66.04 X6.A23 44.45,66.04 36.83,66.04 JP2.13
N$109
  Top 0.61: X5.C23 168.91,68.58 149.86,68.58 X4.C23 147.32,68.58 128.27,68.58 X3.C23 125.73,68.58 106.68,68.58 X2.C23 104.14,68.58 85.09,68.58 X1.C23 82.55,68.58 63.5,68.58 X7.C23 60.96,68.58 41.91,68.58 X6.C23 39.37,68.58 34.29,68.58 JP2.14
N$110
  Bottom 0.61: X5.A24 173.99,68.58 154.94,68.58 X4.A24 152.4,68.58 133.35,68.58 X3.A24 130.81,68.58 111.76,68.58 X2.A24 109.22,68.58 90.17,68.58 X1.A24 87.63,68.58 68.58,68.58 X7.A24 66.04,68.58 46.99,68.58 X6.A24 44.45,68.58 36.83,68.58 JP2.15
N$111
  Top 0.61: X5.C24 168.91,71.12 149.86,71.12 X4.C24 147.32,71.12 128.27,71.12 X3.C24 125.73,71.12 106.68,71.12 X2.C24 104.14,71.12 85.09,71.12 X1.C24 82.55,71.12 63.5,71.12 X7.C24 60.96,71.12 41.91,71.12 X6.C24 39.37,71.12 34.29,71.12 JP2.16
N$112
  Bottom 0.61: X5.A25 173.99,71.12 154.94,71.12 X4.A25 152.4,71.12 133.35,71.12 X3.A25 130.81,71.12 111.76,71.12 X2.A25 109.22,71.12 90.17,71.12 X1.A25 87.63,71.12 68.58,71.12 X7.A25 66.04,71.12 46.99,71.12 X6.A25 44.45,71.12 36.83,71.12 JP2.17
N$113
  Top 0.61: X5.C25 168.91,73.66 149.86,73.66 X4.C25 147.32,73.66 128.27,73.66 X3.C25 125.73,73.66 106.68,73.66 X2.C25 104.14,73.66 85.09,73.66 X1.C25 82.55,73.66 63.5,73.66 X7.C25 60.96,73.66 41.91,73.66 X6.C25 39.37,73.66 34.29,73.66 JP2.18
N$114
  Bottom 0.61: X5.A26 173.99,73.66 154.94,73.66 X4.A26 152.4,73.66 133.35,73.66 X3.A26 130.81,73.66 111.76,73.66 X2.A26 109.22,73.66 90.17,73.66 X1.A26 87.63,73.66 68.58,73.66 X7.A26 66.04,73.66 46.99,73.66 X6.A26 44.45,73.66 36.83,73.66 JP2.19
N$115
  Top 0.61: X5.C26 168.91,76.2 149.86,76.2 X4.C26 147.32,76.2 128.27,76.2 X3.C26 125.73,76.2 106.68,76.2 X2.C26 104.14,76.2 85.09,76.2 X1.C26 82.55,76.2 63.5,76.2 X7.C26 60.96,76.2 41.91,76.2 X6.C26 39.37,76.2 34.29,76.2 JP2.20
N$116
  Bottom 0.61: X5.A27 173.99,76.2 154.94,76.2 X4.A27 152.4,76.2 133.35,76.2 X3.A27 130.81,76.2 111.76,76.2 X2.A27 109.22,76.2 90.17,76.2 X1.A27 87.63,76.2 68.58,76.2 X7.A27 66.04,76.2 46.99,76.2 X6.A27 44.45,76.2 36.83,76.2 JP2.21
N$117
  Top 0.61: X5.C27 168.91,78.74 149.86,78.74 X4.C27 147.32,78.74 128.27,78.74 X3.C27 125.73,78.74 106.68,78.74 X2.C27 104.14,78.74 85.09,78.74 X1.C27 82.55,78.74 63.5,78.74 X7.C27 60.96,78.74 41.91,78.74 X6.C27 39.37,78.74 34.29,78.74 JP2.22
N$118
  Bottom 0.61: X5.A28 173.99,78.74 154.94,78.74 X4.A28 152.4,78.74 133.35,78.74 X3.A28 130.81,78.74 111.76,78.74 X2.A28 109.22,78.74 90.17,78.74 X1.A28 87.63,78.74 68.58,78.74 X7.A28 66.04,78.74 46.99,78.74 X6.A28 44.45,78.74 36.83,78.74 JP2.23
N$119
  Top 0.61: X5.C28 168.91,81.28 149.86,81.28 X4.C28 147.32,81.28 128.27,81.28 X3.C28 125.73,81.28 106.68,81.28 X2.C28 104.14,81.28 85.09,81.28 X1.C28 82.55,81.28 63.5,81.28 X7.C28 60.96,81.28 41.91,81.28 X6.C28 39.37,81.28 34.29,81.28 JP2.24
N$120
  Bottom 0.61: X5.A29 173.99,81.28 154.94,81.28 X4.A29 152.4,81.28 133.35,81.28 X3.A29 130.81,81.28 111.76,81.28 X2.A29 109.22,81.28 90.17,81.28 X1.A29 87.63,81.28 68.58,81.28 X7.A29 66.04,81.28 46.99,81.28 X6.A29 44.45,81.28 36.83,81.28 JP2.25
N$121
  Top 0.61: X5.C29 168.91,83.82 149.86,83.82 X4.C29 147.32,83.82 128.27,83.82 X3.C29 125.73,83.82 106.68,83.82 X2.C29 104.14,83.82 85.09,83.82 X1.C29 82.55,83.82 63.5,83.82 X7.C29 60.96,83.82 41.91,83.82 X6.C29 39.37,83.82 34.29,83.82 JP2.26
N$122
  Bottom 0.61: X5.A30 173.99,83.82 154.94,83.82 X4.A30 152.4,83.82 133.35,83.82 X3.A30 130.81,83.82 111.76,83.82 X2.A30 109.22,83.82 90.17,83.82 X1.A30 87.63,83.82 68.58,83.82 X7.A30 66.04,83.82 46.99,83.82 X6.A30 44.45,83.82 36.83,83.82 JP2.27
N$123
  Top 0.61: X5.C30 168.91,86.36 149.86,86.36 X4.C30 147.32,86.36 128.27,86.36 X3.C30 125.73,86.36 106.68,86.36 X2.C30 104.14,86.36 85.09,86.36 X1.C30 82.55,86.36 63.5,86.36 X7.C30 60.96,86.36 41.91,86.36 X6.C30 39.37,86.36 34.29,86.36 JP2.28
N$124
  Bottom 0.61: X5.A31 173.99,86.36 154.94,86.36 X4.A31 152.4,86.36 133.35,86.36 X3.A31 130.81,86.36 111.76,86.36 X2.A31 109.22,86.36 90.17,86.36 X1.A31 87.63,86.36 68.58,86.36 X7.A31 66.04,86.36 46.99,86.36 X6.A31 44.45,86.36 36.83,86.36 JP2.29
N$125
  Top 0.61: X5.C31 168.91,88.9 149.86,88.9 X4.C31 147.32,88.9 128.27,88.9 X3.C31 125.73,88.9 106.68,88.9 X2.C31 104.14,88.9 85.09,88.9 X1.C31 82.55,88.9 63.5,88.9 X7.C31 60.96,88.9 41.91,88.9 X6.C31 39.37,88.9 34.29,88.9 JP2.30
PS_ON
  Top 0.61: S1.1 13.97,85.09 15.24,83.82 JP3.3
  Bottom 0.61: X9.14 12.75,35.51 11.43,36.83 11.43,86.36 S1.1
PWROK
  Top 0.61: JP3.2 22.86,20.32 21.59,19.05 19.6,19.05 arc90 X9.8
  Bottom 0.61: R1.P$2 24.13,87.63 22.86,86.36 JP3.2

### Text on the board
bPlace: RA conn DIN41612-C AMP 650945-5 | Straight conn DIN41612-C AMP 535059-4 | 64 Pin Terminal Samtek TLW-132-06-F-D SLW-132-01-F-D